# EAGLE schematic HM-Relais4-v01-002-Umrisse (EAGLE 9.5.1)
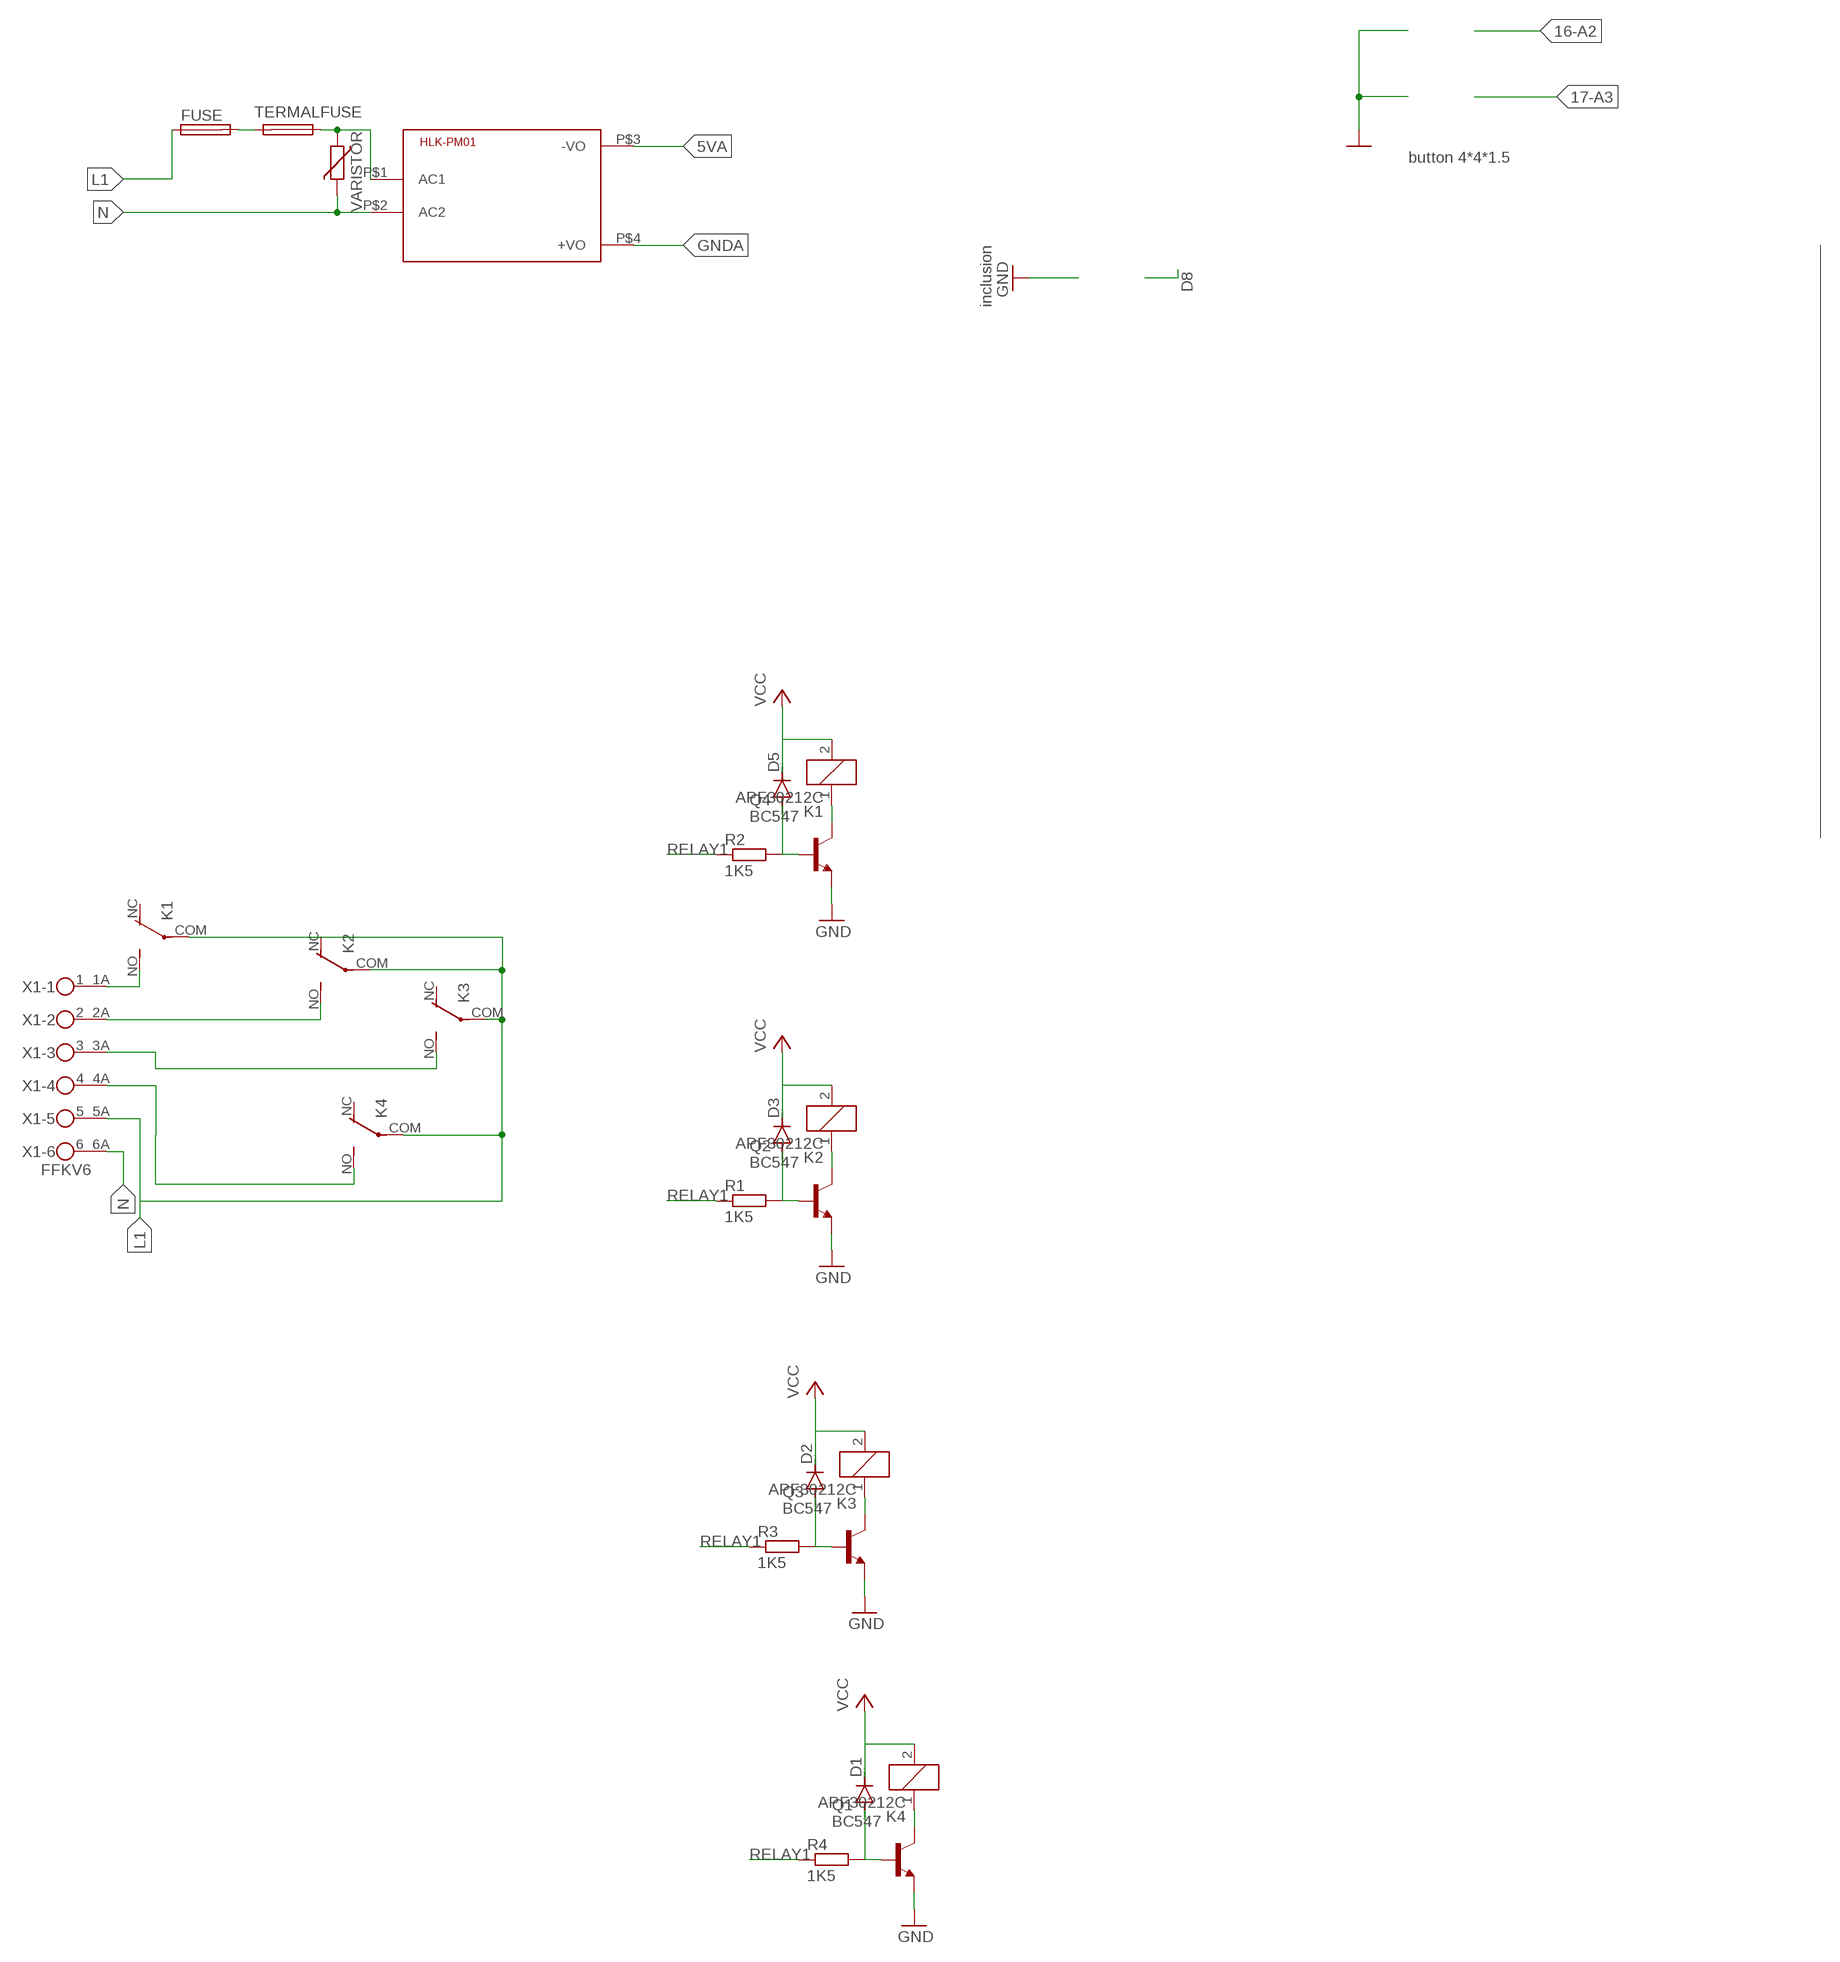
[diagram p0: schematic, sheet 1]

## Parts
D1  DIODE-D-2.5  [D-2.5]
D2  DIODE-D-2.5  [D-2.5]
D3  DIODE-D-2.5  [D-2.5]
D5  DIODE-D-2.5  [D-2.5]
FUSE  FUSETE5  [TE5]
HLK-PM01  HKLPM01  [HKLPM01]
K1  APF30212C  [APF30212C]
K2  APF30212C  [APF30212C]
K3  APF30212C  [APF30212C]
K4  APF30212C  [APF30212C]
Q1  BC547  [TO92]
Q2  BC547  [TO92]
Q3  BC547  [TO92]
Q4  BC547  [TO92]
R1  1K5  R-EU_0207/2V  [0207/2V]
R2  1K5  R-EU_0207/2V  [0207/2V]
R3  1K5  R-EU_0207/2V  [0207/2V]
R4  1K5  R-EU_0207/2V  [0207/2V]
TERMALFUSE  FUSETE5  [TE5]
VARISTOR  VARISTOR-7,5  [R-7,5]
X1  FFKV6  [FFKV6]

## Nets
5VA: HLK-PM01.P$3(-VO)
GND [Power]: Q1.1(E) Q2.1(E) Q3.1(E) Q4.1(E)
GNDA: HLK-PM01.P$4(+VO)
L1: FUSE.1 K1.COM(2:P) K2.COM(2:P) K3.COM(2:P) K4.COM(2:P) X1.5A
N: HLK-PM01.P$2(AC2) VARISTOR.2 X1.6A
N$1: FUSE.2 TERMALFUSE.2
N$2: K2.1 Q2.3(C)
N$3: D3.A Q2.2(B) R1.2
N$5: K3.1 Q3.3(C)
N$6: D2.A Q3.2(B) R3.2
N$7: HLK-PM01.P$1(AC1) TERMALFUSE.1 VARISTOR.1
N$8: K4.1 Q1.3(C)
N$9: D1.A Q1.2(B) R4.2
N$10: K1.NO(2:S) X1.1A
N$11: K2.NO(2:S) X1.2A
N$12: K3.NO(2:S) X1.3A
N$13: K1.1 Q4.3(C)
N$14: K4.NO(2:S) X1.4A
N$16: D5.A Q4.2(B) R2.2
RELAY1: R1.1 R2.1 R3.1 R4.1
VCC [Power]: D1.C D2.C D3.C D5.C K1.2 K2.2 K3.2 K4.2
Unconnected: K1.NC(2:O) K2.NC(2:O) K3.NC(2:O) K4.NC(2:O) X1.1 X1.2 X1.3 X1.4 X1.5 X1.6

## Notes on the sheet
- button 4*4*1.5
- inclusion

## Library data of the parts
D1-D3 D5 = diode:DIODE-: DIODE
FUSE TERMALFUSE = fuse:FUSE: Fuse; OC_FARNELL: unknown; OC_NEWARK: unknown
HLK-PM01 = HKLPM01:HKLPM01
K1-K4 = relay:APF30212C: Compliant with European standards 1a/1c 6A Slim power relays Source: Data sheet <http://pewa.panasonic.com/assets/pcsd/catalog/pf-catalog.pdf>; OC_FARNELL: unknown
Q1-Q4 = transistor-npn:BC547*: NPN Transistor
R1-R4 = rcl:R-EU_: RESISTOR, European symbol; SPICEPREFIX: R
VARISTOR = varistor:VARISTOR: VARISTOR
X1 = con-phoenix-508:FFKV6: PHOENIX; OC_FARNELL: unknown; OC_NEWARK: unknown

## Net classes
0 default: width 0.305 mm
1 Power: width 0.508 mm